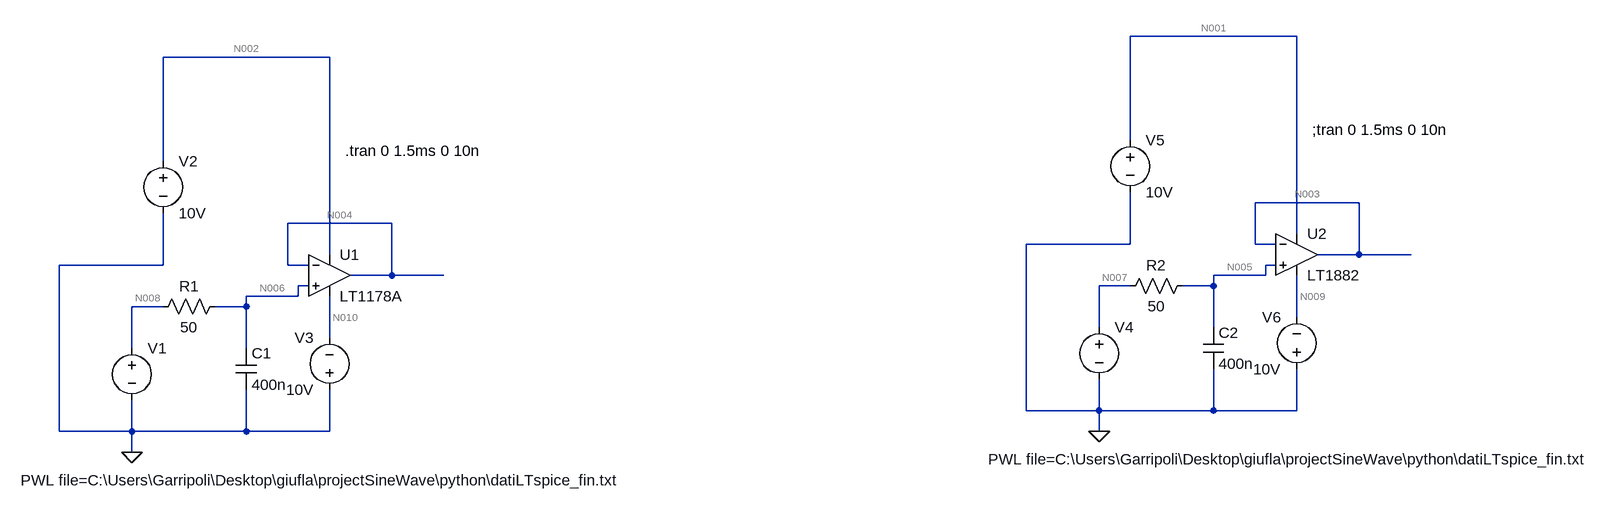
[diagram p0: schematic senoPWM.asc]
* senoPWM.asc
V1 N008 0 PWL file=C:\Users\Garripoli\Desktop\giufla\projectSineWave\python\datiLTspice_fin.txt
R1 N006 N008 50
C1 N006 0 400n
V2 N002 0 10V
V3 0 N010 10V
XU1 N006 N004 N002 N010 N004 LT1178A  ; pins In+ In- V+ V- OUT
V4 N007 0 PWL file=C:\Users\Garripoli\Desktop\giufla\projectSineWave\python\datiLTspice_fin.txt
R2 N005 N007 50
C2 N005 0 400n
V5 N001 0 10V
V6 0 N009 10V
* U2: LT1882 (symbol Opamps\LT1882 not available, pins judged from their places): In+=N005 In-=N003 V+=N001 V-=N009 OUT=N003
.tran 0 1.5ms 0 10n
;tran 0 1.5ms 0 10n
.backanno
.end

* Results of the author's LTspice run, read from the files saved beside the schematic
* Operating Point, zero values left out:
*   V(n008) = 3.3 V
*   V(n006) = 3.3 V
*   V(n002) = 10 V
*   V(n010) = -10 V
*   V(n004) = 3.3 V
*   V(n007) = 3.3 V
*   V(n005) = 3.3 V
*   V(n001) = 10 V
*   V(n009) = -10 V
*   V(n003) = 3.3 V
*   I(R2) = -16.6 pA
*   I(R1) = 2.726 nA
*   I(V6) = -637.9 µA
*   I(V5) = -637.9 µA
*   I(V4) = -16.6 pA
*   I(V3) = -13 µA
*   I(V2) = -13 µA
*   I(V1) = 2.726 nA
*   Ix(u1:1) = -2.726 nA
*   Ix(u1:2) = -2.726 nA
*   Ix(u1:3) = 13 µA
*   Ix(u1:4) = -13 µA
*   Ix(u1:5) = 2.719 nA
*   Ix(u2:1) = 16.6 pA
*   Ix(u2:2) = 16.4 pA
*   Ix(u2:3) = 637.9 µA
*   Ix(u2:4) = -637.9 µA
*   Ix(u2:5) = -23 pA
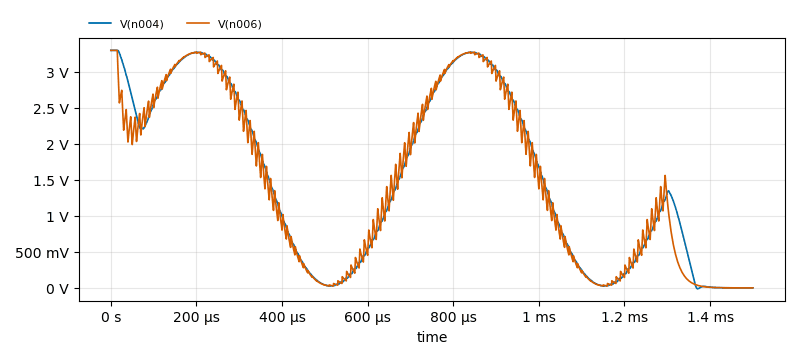
[diagram p1: Transient Analysis of senoPWM.asc, plotted from the saved traces]
* Transient Analysis, 1 run:
*   V(n004): min -12.68 mV, max 3.3 V, average 1.521 V, rms 1.948 V, last 58.7 µV
*   V(n006): min 55.44 µV, max 3.3 V, average 1.485 V, rms 1.915 V, last 55.44 µV